# Altium schematic sheet memorycard.SchDoc: foxBMS BMS-Extension
size A3; DocumentNumber: 10; SheetNumber: 10; SheetTotal: 14; Author: Fraunhofer IISB foxBMS Team; REL-DATE: 2017-05-16; VERSION: 1.0.2; GateName_1: G$1; SymbolName_1: FRAME_B_L; LibraryName: foxBMS_BMS-Master_V1.00_A; DeviceSetName: FRAME_B_L; GateName_2: G$2; SymbolName_2: DOCFIELD; SheetDescription: Memorycard
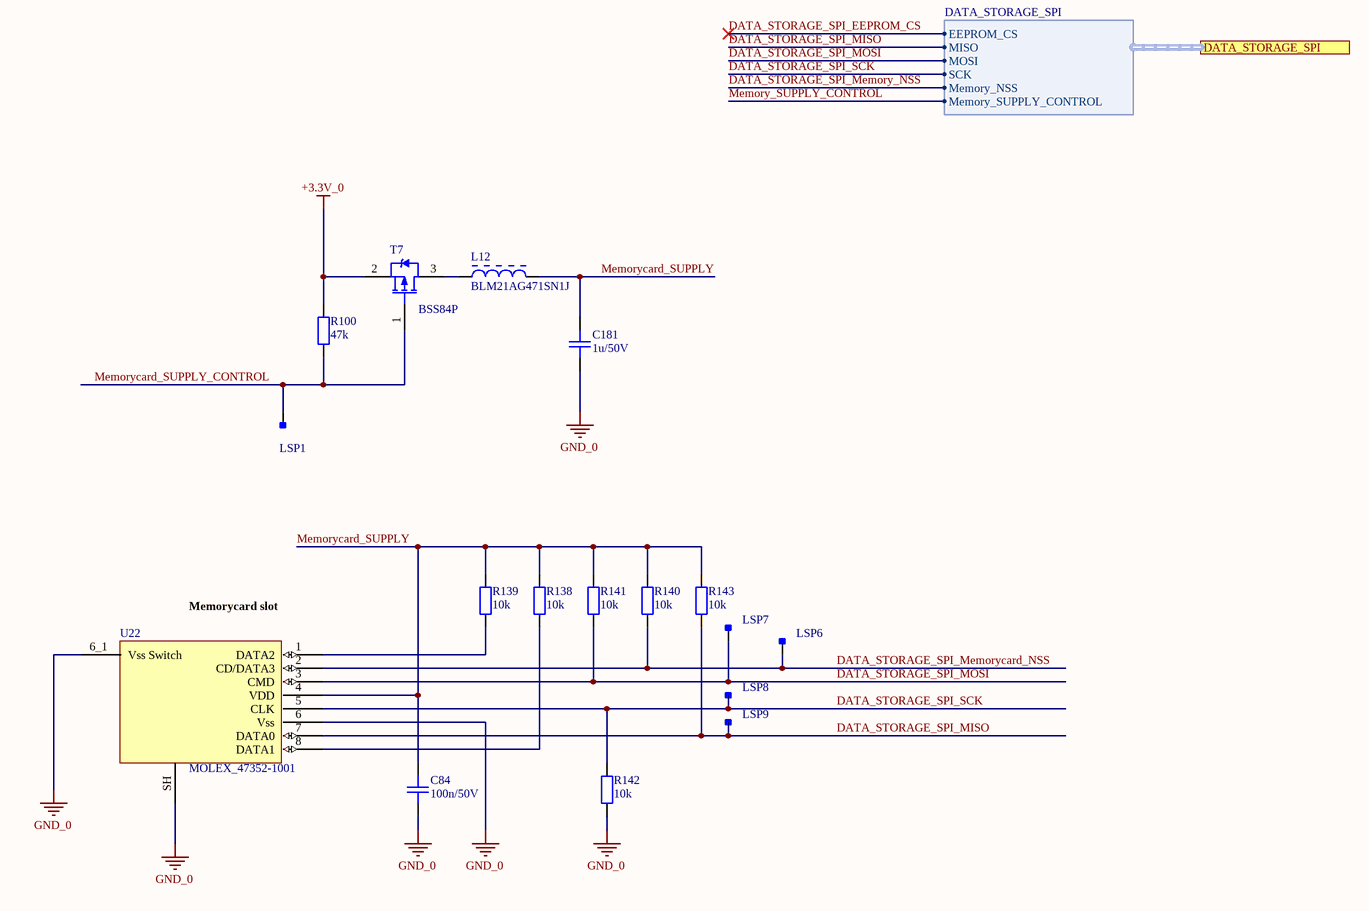
[diagram p0: memorycard.SchDoc]

## Parts
C84  100n/50V  [0603C]
C181  1u/50V  [0603C]
L12  BLM21AG471SN1J  [MURA-BLM21-H1-CHIP-2_V]
LSP1  Testpoint_Square  [Testpoint_S1]  (value not drawn)  (no BOM)
LSP6  Testpoint_Square  [Testpoint_S1]  (value not drawn)  (no BOM)
LSP7  Testpoint_Square  [Testpoint_S1]  (value not drawn)  (no BOM)
LSP8  Testpoint_Square  [Testpoint_S1]  (value not drawn)  (no BOM)
LSP9  Testpoint_Square  [Testpoint_S1]  (value not drawn)  (no BOM)
R100  47k  [0603R]
R138  10k  [0603R]
R139  10k  [0603R]
R140  10k  [0603R]
R141  10k  [0603R]
R142  10k  [0603R]
R143  10k  [0603R]
T7  BSS84P  [INF-PG-SOT23_N]
U22  MOLEX_47352-1001  [MOLEX_47352_1001]

## Ports
DATA_STORAGE_SPI (harness DATA_STORAGE_SPI)

## Harnesses
DATA_STORAGE_SPI: EEPROM_CS, MISO, MOSI, SCK, Memory_NSS, Memory_SUPPLY_CONTROL

## Nets
+3.3V_0: R100.2 T7.2(SOURCE)
GND_0: C84.1 C181.2 R142.1 U22.6(Vss) U22.6_1(Vss_Switch) U22.SH
DATA_STORAGE_SPI_EEPROM_CS: port DATA_STORAGE_SPI.EEPROM_CS
DATA_STORAGE_SPI_Memory_NSS: port DATA_STORAGE_SPI.Memory_NSS
DATA_STORAGE_SPI_Memorycard_NSS: LSP6.1 R140.1 U22.2(CD/DATA3)
DATA_STORAGE_SPI_MISO: LSP9.1 R143.1 U22.7(DATA0) ; port DATA_STORAGE_SPI.MISO
DATA_STORAGE_SPI_MOSI: LSP7.1 R141.1 U22.3(CMD) ; port DATA_STORAGE_SPI.MOSI
DATA_STORAGE_SPI_SCK: LSP8.1 R142.2 U22.5(CLK) ; port DATA_STORAGE_SPI.SCK
Memory_SUPPLY_CONTROL: port DATA_STORAGE_SPI.Memory_SUPPLY_CONTROL
Memorycard_SUPPLY: C84.2 C181.1 L12.1 R138.2 R139.2 R140.2 R141.2 R143.2 U22.4(VDD)
Memorycard_SUPPLY_CONTROL: LSP1.1 R100.1 T7.1(GATE)
NetL12_2: L12.2 T7.3(DRAIN)
NetR138_1: R138.1 U22.8(DATA1)
NetR139_1: R139.1 U22.1(DATA2)

## Notes on the sheet
- (near U22) Memorycard slot
- Fraunhofer IISB
- Schottkystr. 10
- developed by:
- 91058 Erlangen
- Germany
- Author
- Project
- License
- Description
- File
- Version
- Release Date
- Sheet
- www.foxbms.org
- www.iisb.fraunhofer.de
- foxBMS Team
- /

## Library data of the parts
C84 = gen_C_ceramic_100n_50V_X7R_0603: MLCC; Capacitance: 100n; Rated Voltage: 50V; Dielectric: X7R; Case EIA: 0603; Case Metric: 1608; PnP Package: C_0603_10; PnP Value: 100n/50V/X7R; PnP equipped: x; Part Number: gen_C_ceramic_100n_50V_X7R_0603; Supplier 1: Farnell; Supplier Part Number 1: 2525267
C181 = gen_C_ceramic_1u_50V_X7R_0603: MLCC; Capacitance: 1u; Rated Voltage: 50V; Dielectric: X7R; Tolerance: ± 10%; Case EIA: 0603; Case Metric: 1608; Part Number: gen_C_ceramic_1u_50V_X7R_0603; Operating Temperature: -55°C - +125°C; Supplier 1: Farnell; Supplier Part Number 1: 2779055
L12 = CMP-0686-00649-2: Chip Ferrite Bead for General Signal lines, 470 Ohm, 700 mA, -55 to 125 degC, 2 x 1.25 x 1.05 mm SMD, Tape and Reel; Manufacturer: Murata; DC Resistance: 0.19 Ohm Max.; Impedance (at 100 MHz): 470 Ohm +/- 25%; Rated Current: 700 mA; ComponentLink1URL: http://www.murata.com/; Packing: Tape and Reel; PackageDescription: 2-Pin Chip, Body 2 x 1.25 mm; ComponentLink3Description: Package Specification; Operating Temperature Range: -55 to 125 degC; ComponentLink1Description: Manufacturer URL; PartNumber: BLM21AG471SN1J; DatasheetVersion: 08/2013; Mounting Technology: Surface Mount; ComponentLink2URL: http://www.murata.com/products/catalog/pdf/c31e.pdf; ComponentLink3URL: http://www.murata.com/products/catalog/pdf/c31e.pdf; ComponentLink2Description: Datasheet; PackageReference: BLM21_H1050-2
LSP1 LSP6-LSP9 = Testpoint_Square: Testpoint, square; Part Number: Testpoint_Square
R100 = gen_R_47k_0603: SMD Resistor 47k 0603; Tolerance: 1%; Power: 0.1W; Case EIA: 0603; Case Metric: 1608; Maximum Working Voltage: 75V; PnP Package: R_0603; Part Number: gen_R_47k_0603; Operating Temperature: -55°C - +155°C; Resistance: 47k; Series: E24; PnP Value: 47k; Supplier 1: Farnell; Supplier Part Number 1: 2073510
R138-R143 = gen_R_10k_0603: SMD Resistor 10k 0603; Tolerance: 1%; Power: 0.1W; Case EIA: 0603; Case Metric: 1608; Maximum Working Voltage: 75V; PnP Package: R_0603; Part Number: gen_R_10k_0603; Operating Temperature: -55°C - +155°C; Resistance: 10k; Series: E24, E96; PnP Value: 10k; Supplier 1: Farnell; Supplier Part Number 1: 2073349
T7 = CMP-1099-00028-1: P-Channel SIPMOS Small-Signal-Transistor, -60 V VDS, -0.17 A ID, -55 to 150 degC, PG-SOT23, Reel, Green; Manufacturer: Infineon; VGS(th) (max): -2Â V; VGS(th) (min): -1Â V; VDS (max): -60Â V; Rth: 350Â K/W; Pto t (max): 0.36Â W; ID (max): -0.17Â A; IDpuls (max): -0.68Â A; RDS (on) (max) (@4.5V): 12,000Â mOhm; QG: 1Â nC; Green: TRUE; RDS (on) (max): 8,000Â mOhm; ComponentLink3URL: http://www.infineon.com/dgdl/SOT23-Package_Overview.pdf?folderId=db3a30431936bc4b0119532290053c66&fileId=db3a30431936bc4b0119533468123c85; ComponentLink3Description: Package Specification; Packing: Reel; PartNumber: BSS84P; ComponentLink2Description: Datasheet; Mounting Technology: Surface Mount; ComponentLink2URL: http://www.infineon.com/dgdl/BSS84P_Rev2.7%5B1%5D.pdf?folderId=db3a304314dca38901154a72e3951a65&fileId=db3a304330f68606013118ac7a9b4549; PackageReference: PG-SOT23; ComponentLink1URL: http://www.infineon.com/; PackageVersion: Apr-08; ComponentLink1Description: Manufacturer URL; PackageDescription: 3-Pin Small Outline Transistor Package, 2.9 x 1.3 mm Body, 0.95 mm Pitch; Halogen-free: TRUE; DatasheetVersion: Rev. 2.7
U22 = molex_47352-1001: 1.10mm Pitch Memorycard Card Connector, Push-Push Type, with VSS (Supply Voltage Ground) Detect Switch, Lead-Free; Manufacturer: Molex; Circuits: 10; Rated Voltage: 100V DC; Rated Current: 0.5A; Automotive Qualified: False; Part Number: molex_47352-1001; Part Name: 47352-1001; Operating Temperature: -20°C - +85°C; ComponentLink1Description: Drawing; ComponentLink1URL: http://www.molex.com/pdm_docs/sd/473521001_sd.pdf; Supplier 1: Farnell; Supplier Part Number 1: 2424133